# EAGLE design CircMordaza (EAGLE 9.6.2)
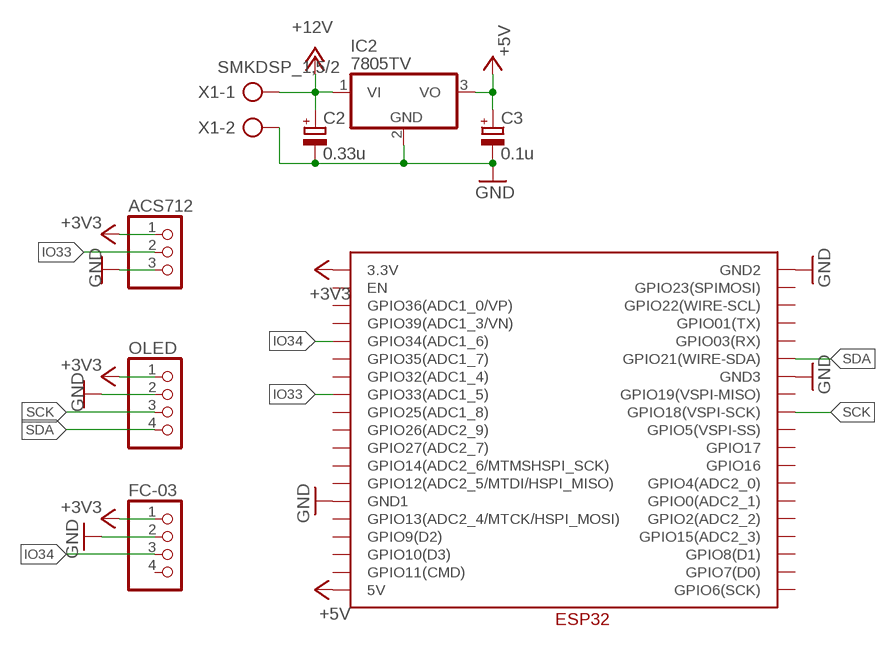
[diagram p0: schematic, sheet 1]

## Parts
ACS712  PINHD-1X3  [1X03]
C2  0.33u  CPOL-EUTT2D6  [TT2D6]
C3  0.1u  CPOL-EUTT2D6  [TT2D6]
FC-03  PINHD-1X4  [1X04]
IC2  7805TV  [TO220V]
OLED  PINHD-1X4  [1X04]
U$1  ESP32WESP32W  [ESP32W]
X1  SMKDSP_1,5/2  [SMKDSP_1,5/2]

## Nets
+3V3: ACS712.1 FC-03.1 OLED.1 U$1.3.3V
+5V: C3.+ IC2.3(VO) U$1.5V
+12V: C2.+ IC2.1(VI) X1.1
GND: ACS712.3 C2.- C3.- FC-03.2 IC2.2(GND) OLED.2 U$1.GND1 U$1.GND2 U$1.GND3 X1.2
IO33: ACS712.2 U$1.GPIO33(GPIO33(ADC1_5))
IO34: FC-03.3 U$1.GPIO34(GPIO34(ADC1_6))
SCK: OLED.3 U$1.GPIO18(GPIO18(VSPI-SCK))
SDA: OLED.4 U$1.GPIO21(GPIO21(WIRE-SDA))
Unconnected: FC-03.4 U$1.CLK(GPIO6(SCK)) U$1.CMD(GPIO11(CMD)) U$1.D2(GPIO9(D2)) U$1.D3(GPIO10(D3)) U$1.EN U$1.GPIO0(GPIO0(ADC2_1)) U$1.GPIO2(GPIO2(ADC2_2)) U$1.GPIO4(GPIO4(ADC2_0)) U$1.GPIO5(GPIO5(VSPI-SS)) U$1.GPIO12(GPIO12(ADC2_5/MTDI/HSPI_MISO)) U$1.GPIO13(GPIO13(ADC2_4/MTCK/HSPI_MOSI)) U$1.GPIO14(GPIO14(ADC2_6/MTMSHSPI_SCK)) U$1.GPIO15(GPIO15(ADC2_3)) U$1.GPIO16 U$1.GPIO17 U$1.GPIO19(GPIO19(VSPI-MISO)) U$1.GPIO22(GPIO22(WIRE-SCL)) U$1.GPIO23(GPIO23(SPIMOSI)) U$1.GPIO25(GPIO25(ADC1_8)) U$1.GPIO26(GPIO26(ADC2_9)) U$1.GPIO27(GPIO27(ADC2_7)) U$1.GPIO32(GPIO32(ADC1_4)) U$1.GPIO35(GPIO35(ADC1_7)) U$1.RX(GPIO03(RX)) U$1.SDI(GPIO8(D1)) U$1.SDO(GPIO7(D0)) U$1.TX(GPIO01(TX)) U$1.VN(GPIO39(ADC1_3/VN)) U$1.VP(GPIO36(ADC1_0/VP))

## Library data of the parts
ACS712 = pinhead:PINHD-1X3: PIN HEADER
C2 C3 = rcl:CPOL-EU: POLARIZED CAPACITOR, European symbol; SPICEPREFIX: C
FC-03 OLED = pinhead:PINHD-1X4: PIN HEADER
IC2 = linear:78*: Positive VOLTAGE REGULATOR Source: http://cache.national.com/ds/LM/LM78L05.pdf http://www.fairchildsemi.com/ds/LM/LM7805.pdf
U$1 = ESP32-WROOM2:ESP32W
X1 = con-phoenix-smkdsp:SMKDSP_1,5/2: Printklemme, Nennstrom: 17,5 A, Bemessungsspannung: 250 V, Raster: 5,0 mm Source: http://eshop.phoenixcontact.de .. 1733415.pdf; MF: FARNELL; MPN: 1733570; OC_FARNELL: 3041244; OC_NEWARK: 69C8588

## Board
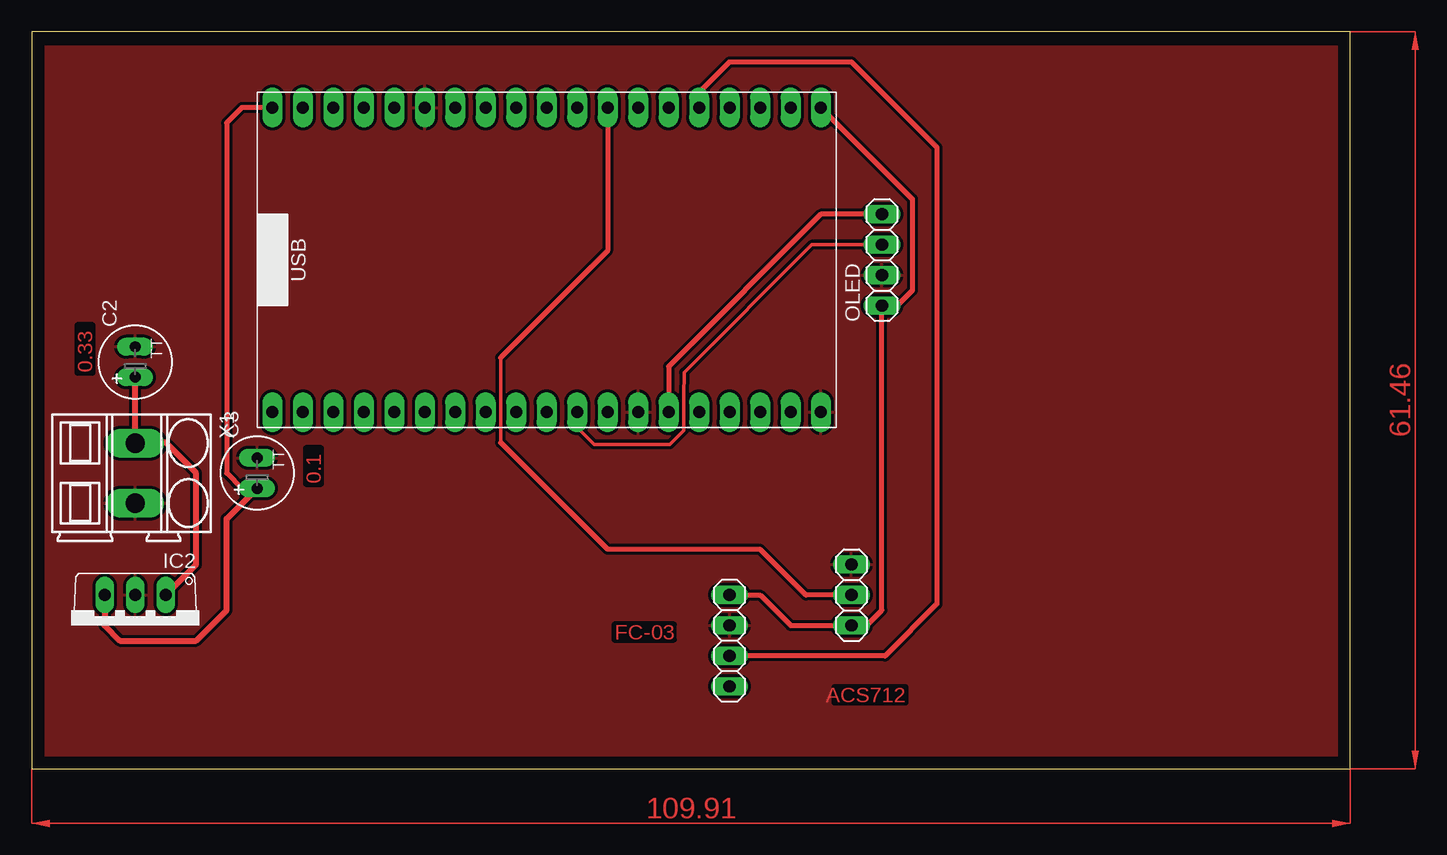
[diagram p1: board, top side]

Size 109.91 x 61.46 mm. Coordinates in mm from the lower left corner, seen from the top.
Outline: 0,0 109.91,0 109.91,61.46 0,61.46 0,0
Copper layers (1*16): Top 0.035mm / dielectric 1.5mm / Bottom 0.035mm
Design rules "default *": minimum track width 16mil, minimum drill 0.35mm, track to track 10mil, track to pad 10mil, pad to pad 10mil, via to via 6mil, smd to smd 6mil, copper to edge 40mil, drill to drill 6mil, minimum pad ring 10mil, minimum via ring 8mil, stop-mask expansion 4mil, vias tented up to drill 0mil, thermal gap 10mil

### Footprints (pad centres in the part's own frame; a part is rotated, then mirrored left to right if it is on the bottom)
1X03 = drill 1.016 long: 1 -2.54,0; 2 0,0; 3 2.54,0
TT2D6 = drill 0.9 pad 1.5 long: + -1.27,0; - 1.27,0
1X04 = drill 1.016 long: 1 -3.81,0; 2 -1.27,0; 3 1.27,0; 4 3.81,0
TO220V = drill 1.016 long: 1 -2.54,-2.54; 2 0,-2.54; 3 2.54,-2.54
ESP32W = drill 1 pad 1.676 long: 3.3V 1.27,46.99; 5V 1.27,1.27; CLK 26.67,1.27; CMD 1.27,3.81; D2 1.27,8.89; D3 1.27,6.35; EN 1.27,44.45; GND1 1.27,13.97; GND2 26.67,46.99; GND3 26.67,31.75; GPIO0 26.67,13.97; GPIO2 26.67,11.43; GPIO4 26.67,16.51; GPIO5 26.67,24.13; GPIO12 1.27,16.51; GPIO13 1.27,11.43; GPIO14 1.27,19.05; GPIO15 26.67,8.89; GPIO16 26.67,19.05; GPIO17 26.67,21.59; GPIO18 26.67,26.67; GPIO19 26.67,29.21; GPIO21 26.67,34.29; GPIO22 26.67,41.91; GPIO23 26.67,44.45; GPIO25 1.27,26.67; GPIO26 1.27,24.13; GPIO27 1.27,21.59; GPIO32 1.27,31.75; GPIO33 1.27,29.21; GPIO34 1.27,36.83; GPIO35 1.27,34.29; RX 26.67,36.83; SDI 26.67,6.35; SDO 26.67,3.81; TX 26.67,39.37; VN 1.27,39.37; VP 1.27,41.91
SMKDSP_1,5/2 = drill 1.6 pad 1.8 long: 1 -2.5,0; 2 2.5,0

### Placement (x,y rotation side)
ACS712  68.33,14.48 90 top
C2  0.33  [TT2D6]  8.64,33.91 90 top
C3  0.1  [TT2D6]  18.8,24.64 90 top
FC-03  58.17,10.67 270 top
IC2  8.64,11.94 180 top
OLED  70.87,42.42 90 top
U$1  18.8,56.39 270 top
X1  8.64,24.64 270 top

### Tracks (layer width: path | path; a pad name or v marks a point on that pad's centre or on a via)
+3V3
  Top 0.406: FC-03.1 60.71,14.48 63.25,11.94 ACS712.1 69.6,11.94 70.87,13.21 OLED.1 72.14,38.61 73.41,39.88 73.41,47.5 U$1.3.3V
+5V
  Top 0.406: U$1.5V 17.53,55.12 16.26,53.85 16.26,24.64 17.53,23.37 C3.+
  Top 0.508: IC2.3 6.1,11.94 7.37,10.67 13.72,10.67 16.26,13.21 16.26,20.83 C3.+
+12V
  Top 0.508: X1.1 8.64,27.18 | 8.64,27.18 C2.+ | 8.64,27.18 11.18,27.18 13.72,24.64 13.72,17.02 IC2.1
GND
  pour Top: 1.02,60.2 1.02,0.89 108.97,0.89 108.97,60.2
IO33
  Top 0.305: 39.09,27.18 39.09,34.27
  Top 0.406: ACS712.2 64.52,14.48 60.71,18.29 48.01,18.29 39.12,27.18 39.09,27.18 | U$1.GPIO33 48.01,43.18 39.09,34.27
IO34
  Top 0.406: U$1.GPIO34 55.63,56.39 58.17,58.93 68.33,58.93 75.44,51.82 75.44,13.72 71.12,9.4 FC-03.3
SCK
  Top 0.305: OLED.3 65.02,43.69 54.38,33.04 54.36,31.01 54.36,28.19 53.2,27.03 46.88,27.03 45.47,28.45
  Top 0.406: 45.47,28.45 U$1.GPIO18
SDA
  Top 0.406: OLED.4 65.79,46.23 53.09,33.53 U$1.GPIO21
(copper drawn outside any net)
  shapes: Top area x2